# Altium schematic sheet Cell.SchDoc
size 152 x 88 mm
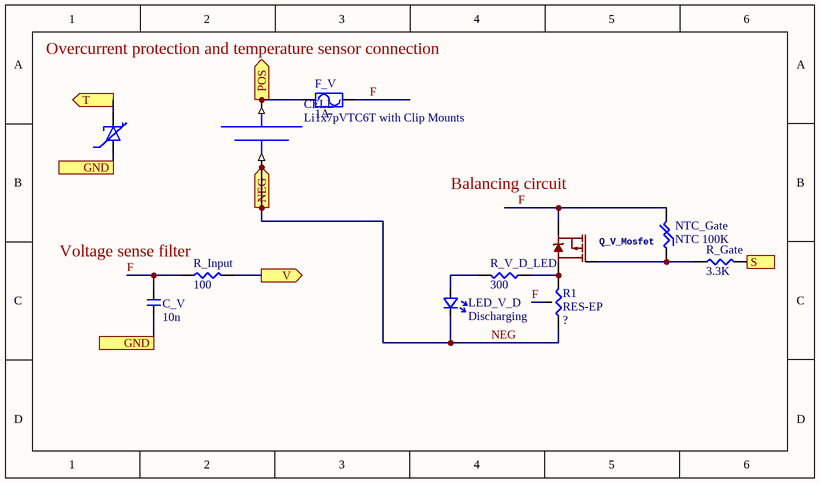
[diagram p0: Cell.SchDoc]

## Parts
C_V  10n  [CAP-0603]
CELL  Li1x7pVTC6T with Clip Mounts  [Li1x7pVTC6T_Clips]
F_V  1A  [2410SMD]
LED_V_D  Discharging  [LED-0603]
NTC_Gate  NTC 100K  [NTC-0603]
Q_V_Mosfet  (no value)  [TO252]
R1  RES-EP  [RES-TO252]
R_Gate  3.3K  [RES-0603]
R_Input  100  [RES-0603]
R_V_D_LED  300  [RES-0603]

## Ports
GND, NEG (in), POS (out), S (in), T (out), V (out)

## Nets
F: C_V.2 F_V.1 NTC_Gate.2 Q_V_Mosfet.3(S) R1.3 R_Input.1
GND: C_V.1 CELL.T- ; port GND
NEG: CELL.- CELL.-L CELL.-O CELL.-R LED_V_D.K R1.1 ; port NEG
POS: CELL.+ CELL.+L CELL.+O CELL.+R F_V.2 ; port POS
S: R_Gate.2 ; port S
T: CELL.T+ ; port T
V: R_Input.2 ; port V
NetLED_V_D_A: LED_V_D.A R_V_D_LED.2
NetNTC_Gate_1: NTC_Gate.1 Q_V_Mosfet.1(G) R_Gate.1
NetQ_V_Mosfet_2: Q_V_Mosfet.2(D) R1.2 R_V_D_LED.1

## Notes on the sheet
- Overcurrent protection and temperature sensor connection
- (near Q_V_Mosfet) Balancing circuit
- (near R_Input) Voltage sense filter

## Library data of the parts
C_V = CAP-0603
CELL = Li1x7pVTC6T_Clip
F_V = 0679L
LED_V_D = LED-0603
NTC_Gate = NTC-0603
Q_V_Mosfet = DMP10H400SK3-13: GateName_1: G$1; SymbolName_1: LABELED-PMOS; LibraryName: IFE_Transistors; DeviceSetName: DMP10H400SK3-13; Package: TO252
R1 = RES_TO252: RES SMD TO252; Company: IFE; Part: RES_TO252; Value: ?; Package: TO252
R_Gate R_Input R_V_D_LED = RES-0603